# Altium project BG1094_R1M1E1.PrjPcb (part 2 of 2)

## Sheet BG1094_RPi3b+_Connector.SchDoc: =project_title
size Tabloid; CompanyName: Luxonis Holding; DrawnBy: Brian Weinstein; Organization: Luxonis Holding; Address1: 1925 Harmony Park Drive; Address2: Westminster, CO; Address3: 80234; Address4: United States; DocumentNumber: D0000194; Revision: R1M1E1; SheetNumber: 5; SheetTotal: 5
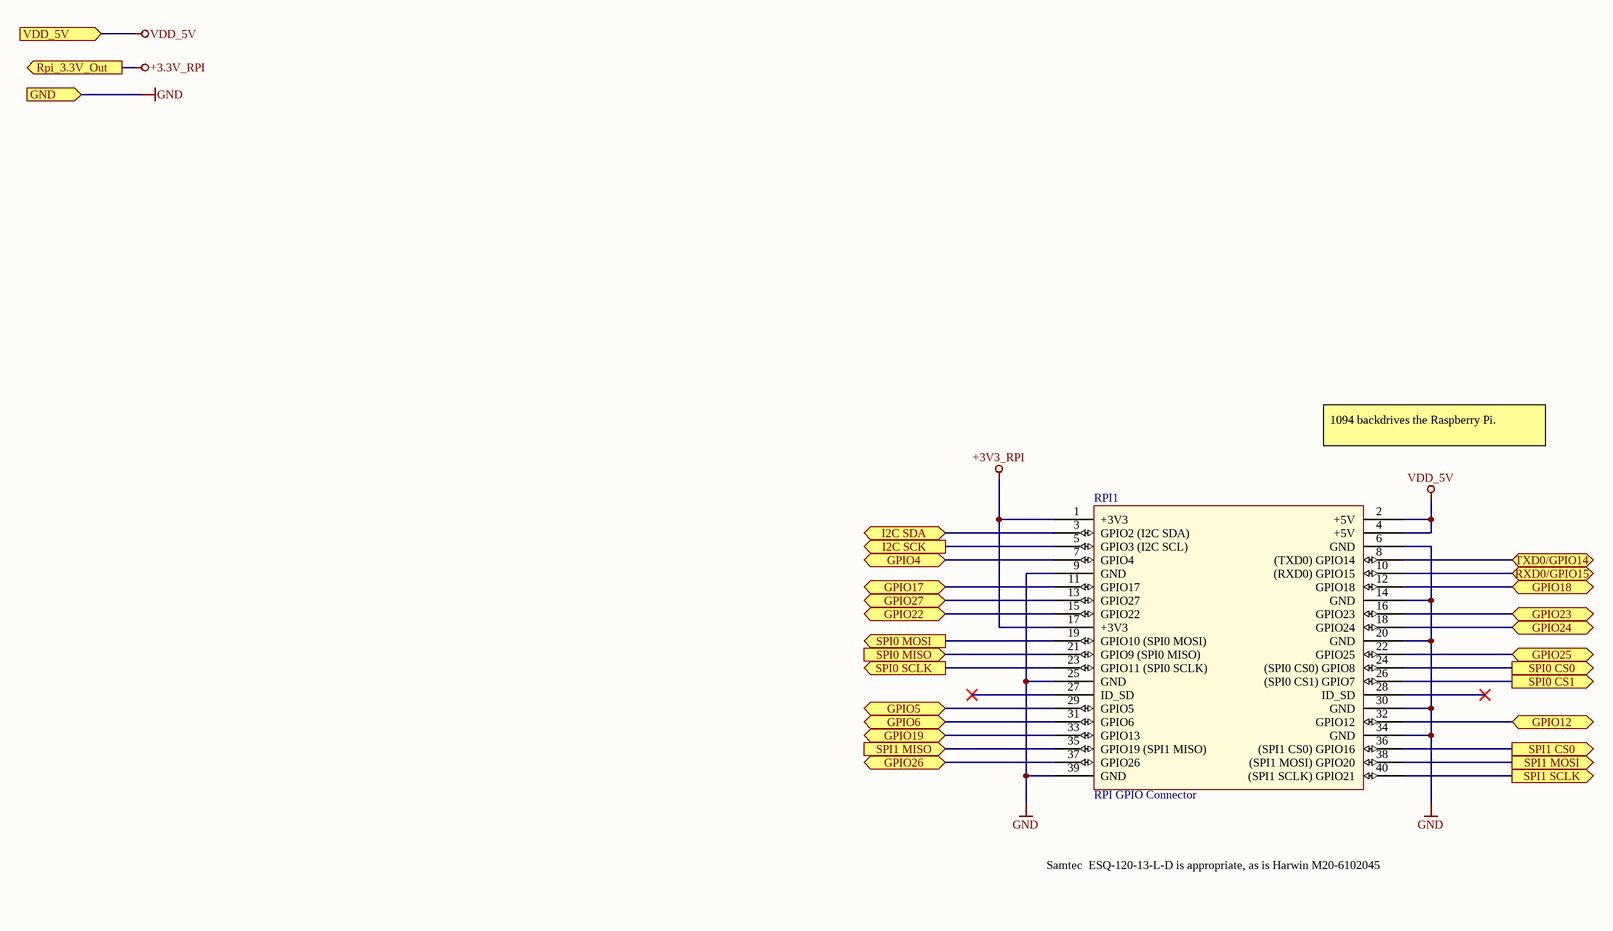
[diagram p4: BG1094_RPi3b+_Connector.SchDoc]

### Parts
RPI1  RPI GPIO Connector  [rpi-hat-40-socket]

### Ports
GND (in), GPIO4 (bidir), GPIO5 (bidir), GPIO6 (bidir), GPIO12 (bidir), GPIO17 (bidir), GPIO18 (bidir), GPIO19 (bidir), GPIO22 (bidir), GPIO23 (bidir), GPIO24 (bidir), GPIO25 (bidir), GPIO26 (bidir), GPIO27 (bidir), I2C SCK (out), I2C SDA (bidir), Rpi_3.3V_Out (out), RXD0/GPIO15 (bidir), SPI0 CS0 (out), SPI0 CS1 (out), SPI0 MISO (in), SPI0 MOSI (out), SPI0 SCLK (out), SPI1 CS0 (out), SPI1 MISO (in), SPI1 MOSI (out), SPI1 SCLK (out), TXD0/GPIO14 (bidir), VDD_5V (in)

### Nets
+3.3V_RPI: port Rpi_3.3V_Out
+3V3_RPI: RPI1.1(+3V3) RPI1.17(+3V3)
GND: RPI1.6(GND) RPI1.9(GND) RPI1.14(GND) RPI1.20(GND) RPI1.25(GND) RPI1.30(GND) RPI1.34(GND) RPI1.39(GND) ; port GND
VDD_5V: RPI1.2(+5V) RPI1.4(+5V) ; port VDD_5V
GPIO4: RPI1.7(GPIO4) ; port GPIO4
GPIO5: RPI1.29(GPIO5) ; port GPIO5
GPIO6: RPI1.31(GPIO6) ; port GPIO6
GPIO12: RPI1.32(GPIO12) ; port GPIO12
GPIO17: RPI1.11(GPIO17) ; port GPIO17
GPIO18: RPI1.12(GPIO18) ; port GPIO18
GPIO19: RPI1.33(GPIO13) ; port GPIO19
GPIO22: RPI1.15(GPIO22) ; port GPIO22
GPIO23: RPI1.16(GPIO23) ; port GPIO23
GPIO24: RPI1.18(GPIO24) ; port GPIO24
GPIO25: RPI1.22(GPIO25) ; port GPIO25
GPIO27: RPI1.13(GPIO27) ; port GPIO27
I2C SCK: RPI1.5(GPIO3_(I2C_SCL)) ; port I2C SCK
I2C SDA: RPI1.3(GPIO2_(I2C_SDA)) ; port I2C SDA
RXD0/GPIO15: RPI1.10((RXD0)_GPIO15) ; port RXD0/GPIO15
SPI0 CS0: RPI1.24((SPI0_CS0)_GPIO8) ; port SPI0 CS0
SPI0 CS1: RPI1.26((SPI0_CS1)_GPIO7) ; port SPI0 CS1
SPI0 MISO: RPI1.21(GPIO9_(SPI0_MISO)) ; port SPI0 MISO
SPI0 MOSI: RPI1.19(GPIO10_(SPI0_MOSI)) ; port SPI0 MOSI
SPI0 SCLK: RPI1.23(GPIO11_(SPI0_SCLK)) ; port SPI0 SCLK
SPI1 CS0: RPI1.36((SPI1_CS0)_GPIO16) ; port SPI1 CS0
SPI1 MISO: RPI1.35(GPIO19_(SPI1_MISO)) ; port SPI1 MISO
SPI1 MOSI: RPI1.38((SPI1_MOSI)_GPIO20) ; port SPI1 MOSI
SPI1 SCLK: RPI1.40((SPI1_SCLK)_GPIO21) ; port SPI1 SCLK
SYS_RST: RPI1.37(GPIO26) ; port GPIO26
TXD0/GPIO14: RPI1.8((TXD0)_GPIO14) ; port TXD0/GPIO14

Not connected (* = marked no-connect by the designer): RPI1 27(ID_SD)* 28(ID_SD)*

### Notes on the sheet
- 1094 backdrives the Raspberry Pi.
- Samtec 	ESQ-120-13-L-D is appropriate, as is Harwin M20-6102045
- Title
- Size:
- Date:
- Tabloid
- Number:
- Time:
- Revision:
- Sheet
- of
- Drawn by:

### Library data of the parts
RPI1 = RPi HAT 40 Pin Connector: GPIO Header for Raspberry Pi A+/B+/Pi 2/Pi 3 - 2x20; nilsminor@web.de: mail; RoHS: RoHS Compliant; Category: Development Boards, Kits, Programmers; Stock 1: 150; Pricing 1: 1=1.84 (EUR); Part Status: Active; Accessory Type: Connector; For Use With/Related Products: Raspberry Pi; ComponentLink1URL: https://cdn.sparkfun.com/datasheets/Dev/RaspberryPi/12313.pdf; ComponentLink1Description: https://cdn.sparkfun.com/datasheets/Dev/RaspberryPi/12313.pdf

## Sheet Project_Information.SchDoc: =project_title
size Tabloid; CompanyName: Luxonis Holding; DrawnBy: Brian Weinstein; Organization: Luxonis Holding; Address1: 1925 Harmony Park Drive; Address2: Westminster, CO; Address3: 80234; Address4: United States; DocumentNumber: D0000194; Revision: R1M1E1; SheetNumber: 1; SheetTotal: 17
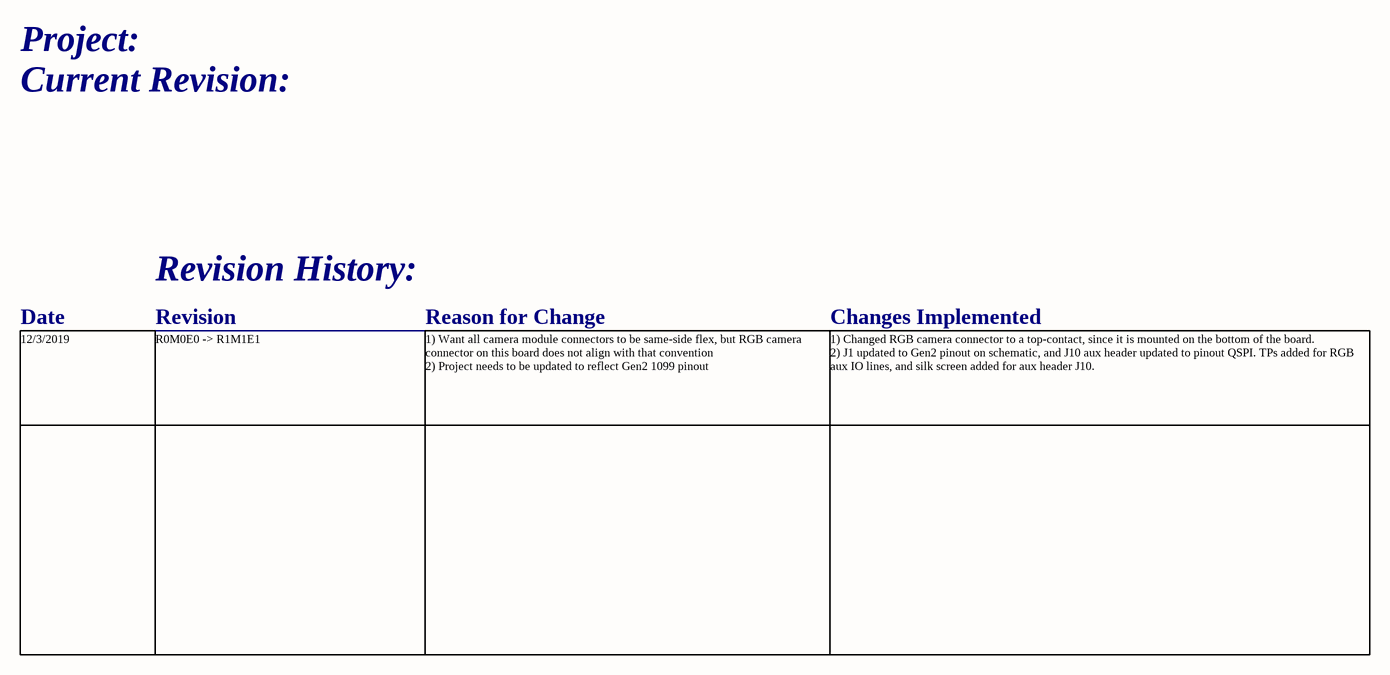
[diagram p5: Project_Information.SchDoc]

### Notes on the sheet
- Project:
- Current Revision:
- Revision History:
- Date
- Revision
- Reason for Change
- Changes Implemented
- 12/3/2019
- R0M0E0 -> R1M1E1
- 1) Want all camera module connectors to be same-side flex, but RGB camera connector on this board does not align with that convention
  2) Project needs to be updated to reflect Gen2 1099 pinout
- 1) Changed RGB camera connector to a top-contact, since it is mounted on the bottom of the board.
  2) J1 updated to Gen2 pinout on schematic, and J10 aux header updated to pinout QSPI. TPs added for RGB aux IO lines, and silk screen added for aux header J10.
- Title
- Size:
- Date:
- Tabloid
- Number:
- Time:
- Revision:
- Sheet
- of
- Drawn by:

## Nets that join several sheets
3.3VIN: BG1094_TopLevel (C1.2 TP33.1 U1.1), BG1094_USB (C74.2 R186.2 U61.6)
GND: BG1094_TopLevel (15 pins), BG1094_Connector (44 pins), BG1094_MIPI_CAM (26 pins), BG1094_USB (28 pins), BG1094_RPi3b+_Connector (8 pins)
VBUS: BG1094_Connector (J1.53), BG1094_USB (12 pins)
VDD_5V: BG1094_TopLevel (10 pins), BG1094_Connector (8 pins), BG1094_MIPI_CAM (6 pins), BG1094_USB (C76.2 R213.2 R214.2 U62.12), BG1094_RPi3b+_Connector (RPI1.2 RPI1.4)
2485_PGOOD: BG1094_TopLevel (M3.1), BG1094_Connector (J1.37 J10.17)
CAM_A_CLK_OUT: BG1094_Connector (J1.28), BG1094_MIPI_CAM (J6.17)
CAM_A_PWDN_N: BG1094_Connector (J1.34), BG1094_MIPI_CAM (J6.18)
CAM_B_CLK_OUT: BG1094_Connector (J1.73), BG1094_MIPI_CAM (J8.14 J9.14)
CAM_B_D_PWM: BG1094_Connector (J1.65), BG1094_MIPI_CAM (J9.12)
CAM_B_PWDN_N: BG1094_Connector (J1.67), BG1094_MIPI_CAM (J8.12)
CAM_L_C_N: BG1094_Connector (J1.95), BG1094_MIPI_CAM (J8.2)
CAM_L_C_P: BG1094_Connector (J1.97), BG1094_MIPI_CAM (J8.3)
CAM_L_D0_N: BG1094_Connector (J1.89), BG1094_MIPI_CAM (J8.5)
CAM_L_D0_P: BG1094_Connector (J1.91), BG1094_MIPI_CAM (J8.6)
CAM_L_D1_N: BG1094_Connector (J1.83), BG1094_MIPI_CAM (J8.16)
CAM_L_D1_P: BG1094_Connector (J1.85), BG1094_MIPI_CAM (J8.17)
CAM_R_C_N: BG1094_Connector (J1.96), BG1094_MIPI_CAM (J9.2)
CAM_R_C_P: BG1094_Connector (J1.98), BG1094_MIPI_CAM (J9.3)
CAM_R_D0_N: BG1094_Connector (J1.90), BG1094_MIPI_CAM (J9.5)
CAM_R_D0_P: BG1094_Connector (J1.92), BG1094_MIPI_CAM (J9.6)
CAM_R_D1_N: BG1094_Connector (J1.84), BG1094_MIPI_CAM (J9.16)
CAM_R_D1_P: BG1094_Connector (J1.86), BG1094_MIPI_CAM (J9.17)
COM_AUX_IO2: BG1094_Connector (J1.42 TP2.1), BG1094_MIPI_CAM (R2.1)
I2C1_SCL: BG1094_Connector (J1.35), BG1094_MIPI_CAM (J6.21)
I2C1_SDA: BG1094_Connector (J1.33), BG1094_MIPI_CAM (J6.20)
I2C2_SCL: BG1094_Connector (J1.77), BG1094_MIPI_CAM (J8.11 J9.11)
I2C2_SDA: BG1094_Connector (J1.79), BG1094_MIPI_CAM (J8.10 J9.10)
MIPI_C_N: BG1094_Connector (J1.3), BG1094_MIPI_CAM (J6.9)
MIPI_C_P: BG1094_Connector (J1.5), BG1094_MIPI_CAM (J6.8)
MIPI_D0_N: BG1094_Connector (J1.9), BG1094_MIPI_CAM (J6.6)
MIPI_D0_P: BG1094_Connector (J1.11), BG1094_MIPI_CAM (J6.5)
MIPI_D1_N: BG1094_Connector (J1.15), BG1094_MIPI_CAM (J6.11)
MIPI_D1_P: BG1094_Connector (J1.17), BG1094_MIPI_CAM (J6.12)
MIPI_D2_N: BG1094_Connector (J1.21), BG1094_MIPI_CAM (J6.3)
MIPI_D2_P: BG1094_Connector (J1.23), BG1094_MIPI_CAM (J6.2)
MIPI_D3_N: BG1094_Connector (J1.27), BG1094_MIPI_CAM (J6.15)
MIPI_D3_P: BG1094_Connector (J1.29), BG1094_MIPI_CAM (J6.14)
SYS_RST: BG1094_Connector (R1.2 R5.2), BG1094_RPi3b+_Connector (RPI1.37)
USB_D_N: BG1094_Connector (J1.18), BG1094_USB (L20.3)
USB_D_P: BG1094_Connector (J1.16), BG1094_USB (L20.1)
USB_RX_N: BG1094_Connector (J1.12), BG1094_USB (U61.4)
USB_RX_P: BG1094_Connector (J1.10), BG1094_USB (U61.3)
USB_TX_N: BG1094_Connector (J1.24), BG1094_USB (U61.8)
USB_TX_P: BG1094_Connector (J1.22), BG1094_USB (U61.7)

## Assembly variants
Production: not fitted D27 D28 D29 D36 J10 RZ28 RZ29 Z1